# EAGLE design bbb_cape (EAGLE 7.3.0)
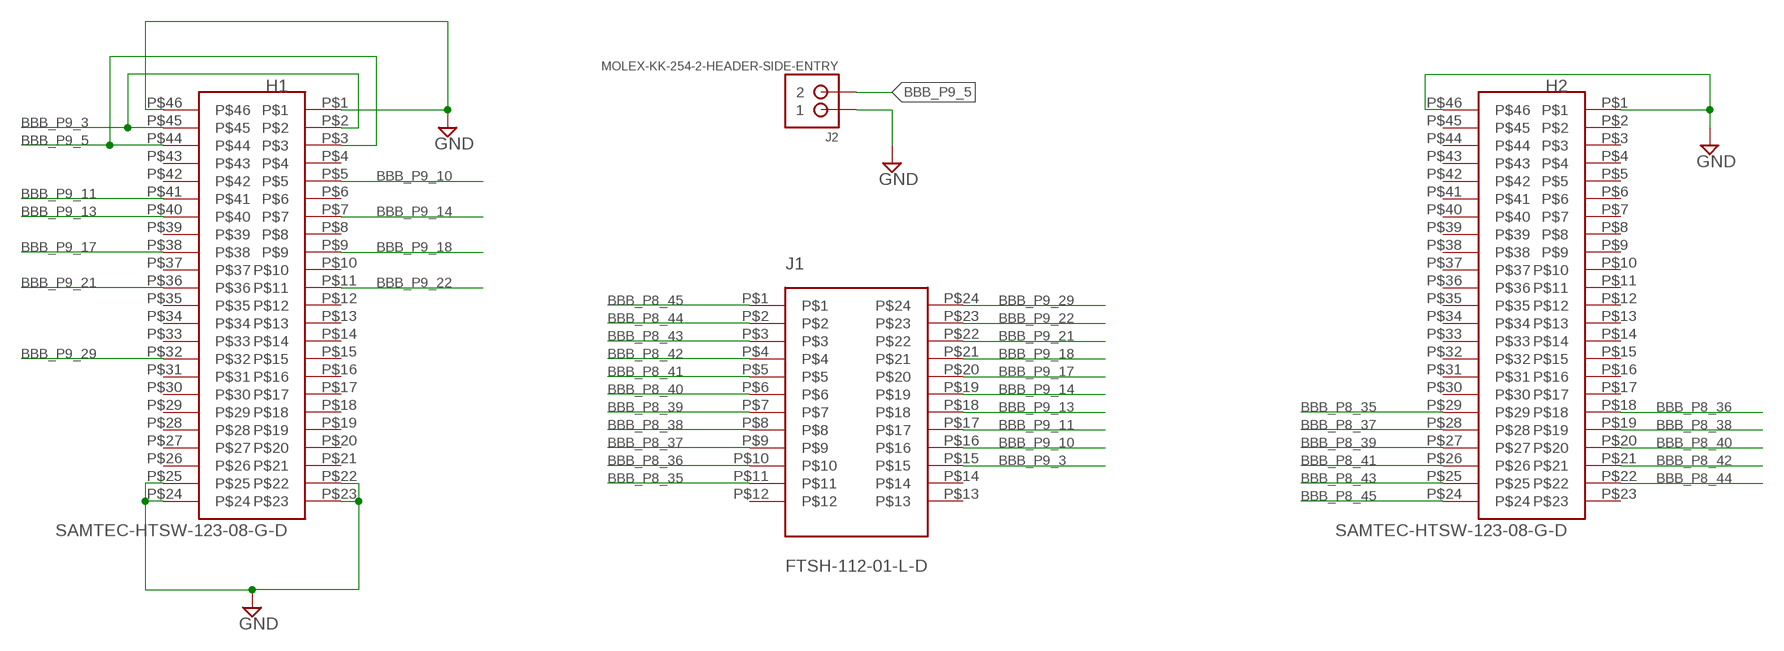
[diagram p0: schematic, sheet 1]

## Parts
H1  SAMTEC-HTSW-123-08-G-D  HEADER-2X23  [HEADER-2X23-0.1-INCH]
H2  SAMTEC-HTSW-123-08-G-D  HEADER-2X23  [HEADER-2X23-0.1-INCH]
J1  FTSH-112-01-L-D  FTSH-112-CONNSTRAIGHT  [FTSH-112-01-L-D]
J2  MOLEX-KK-254-2-HEADER-SIDE-ENTRY  [MOLEX-KK-254-2-HEADER-SIDE-ENTRY]

## Nets
BBB_P8_35: H2.P$29 J1.P$11
BBB_P8_36: H2.P$18 J1.P$10
BBB_P8_37: H2.P$28 J1.P$9
BBB_P8_38: H2.P$19 J1.P$8
BBB_P8_39: H2.P$27 J1.P$7
BBB_P8_40: H2.P$20 J1.P$6
BBB_P8_41: H2.P$26 J1.P$5
BBB_P8_42: H2.P$21 J1.P$4
BBB_P8_43: H2.P$25 J1.P$3
BBB_P8_44: H2.P$22 J1.P$2
BBB_P8_45: H2.P$24 J1.P$1
BBB_P9_3: H1.P$2 H1.P$45 J1.P$15
BBB_P9_5: H1.P$3 H1.P$44 J2.P$2
BBB_P9_10: H1.P$5 J1.P$16
BBB_P9_11: H1.P$41 J1.P$17
BBB_P9_13: H1.P$40 J1.P$18
BBB_P9_14: H1.P$7 J1.P$19
BBB_P9_17: H1.P$38 J1.P$20
BBB_P9_18: H1.P$9 J1.P$21
BBB_P9_21: H1.P$36 J1.P$22
BBB_P9_22: H1.P$11 J1.P$23
BBB_P9_29: H1.P$32 J1.P$24
GND: H1.P$1 H1.P$22 H1.P$23 H1.P$24 H1.P$25 H1.P$46 H2.P$1 H2.P$46 J2.P$1
Unconnected: H1.P$4 H1.P$6 H1.P$8 H1.P$10 H1.P$12 H1.P$13 H1.P$14 H1.P$15 H1.P$16 H1.P$17 H1.P$18 H1.P$19 H1.P$20 H1.P$21 H1.P$26 H1.P$27 H1.P$28 H1.P$29 H1.P$30 H1.P$31 H1.P$33 H1.P$34 H1.P$35 H1.P$37 H1.P$39 H1.P$42 H1.P$43 H2.P$2 H2.P$3 H2.P$4 H2.P$5 H2.P$6 H2.P$7 H2.P$8 H2.P$9 H2.P$10 H2.P$11 H2.P$12 H2.P$13 H2.P$14 H2.P$15 H2.P$16 H2.P$17 H2.P$23 H2.P$30 H2.P$31 H2.P$32 H2.P$33 H2.P$34 H2.P$35 H2.P$36 H2.P$37 H2.P$38 H2.P$39 H2.P$40 H2.P$41 H2.P$42 H2.P$43 H2.P$44 H2.P$45 J1.P$12 J1.P$13 J1.P$14

## Library data of the parts
H1 H2 = custom:HEADER-2X23: Header, Through Hole, 46 pins (2x23)
J1 = custom:FTSH-112-CONN: SAMTEC FTSH-112-* HEADER, 1.27MM (0.05 in.), 2X12 POSITION 1.75 A Current Rating @ 80 degrees C ambient Mates with FFSD, FFTP, CLP, FLE, SFMC http://www.newark.com/webapp/wcs/stores/servlet/ProductDisplay?catalogId=15003&langId=-1&urlRequestType=Base&partNumber=01R5259&storeId=10194 http://www.newark.com/webapp/wcs/stores/servlet/ProductDisplay?catalogId=15003&langId=-1&urlRequestType=Base&partNumber=01R5256&storeId=10194 Datasheet: http://www.farnell.com/datasheets/1596288.pdf Drawing: http://www.farnell.com/cad/1561347.pdf
J2 = custom:MOLEX-KK-254-2-HEADER-SIDE-ENTRY: Molex KK 254 Wire to Board Header - Side Entry - 22-12-2024 Max current per contact: 4.0 A Max voltage: 250 V 0.1 inch pitch http://www.farnell.com/datasheets/1973599.pdf

## Board
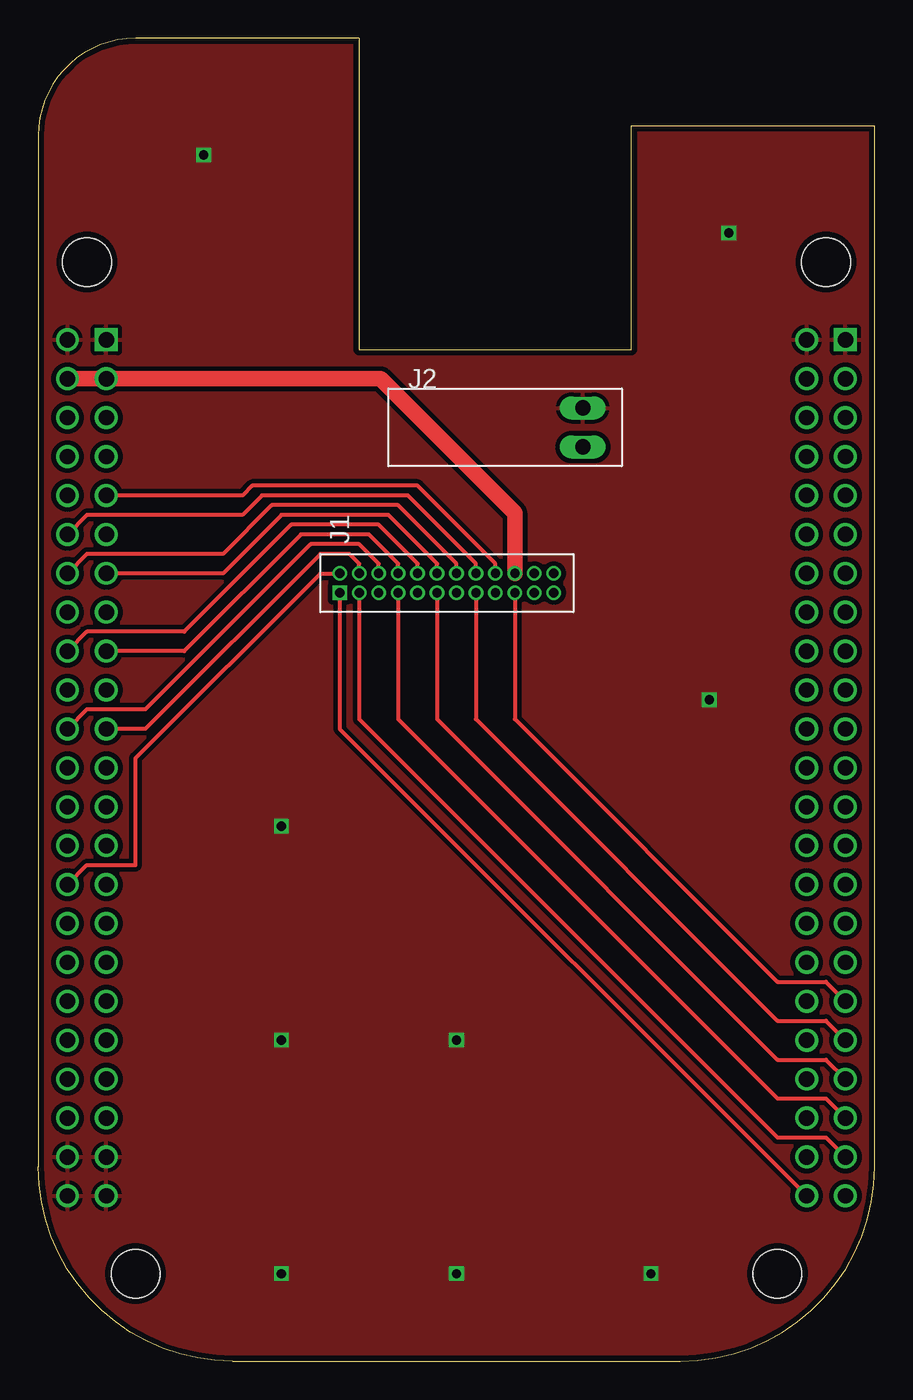
[diagram p1: board, top side]
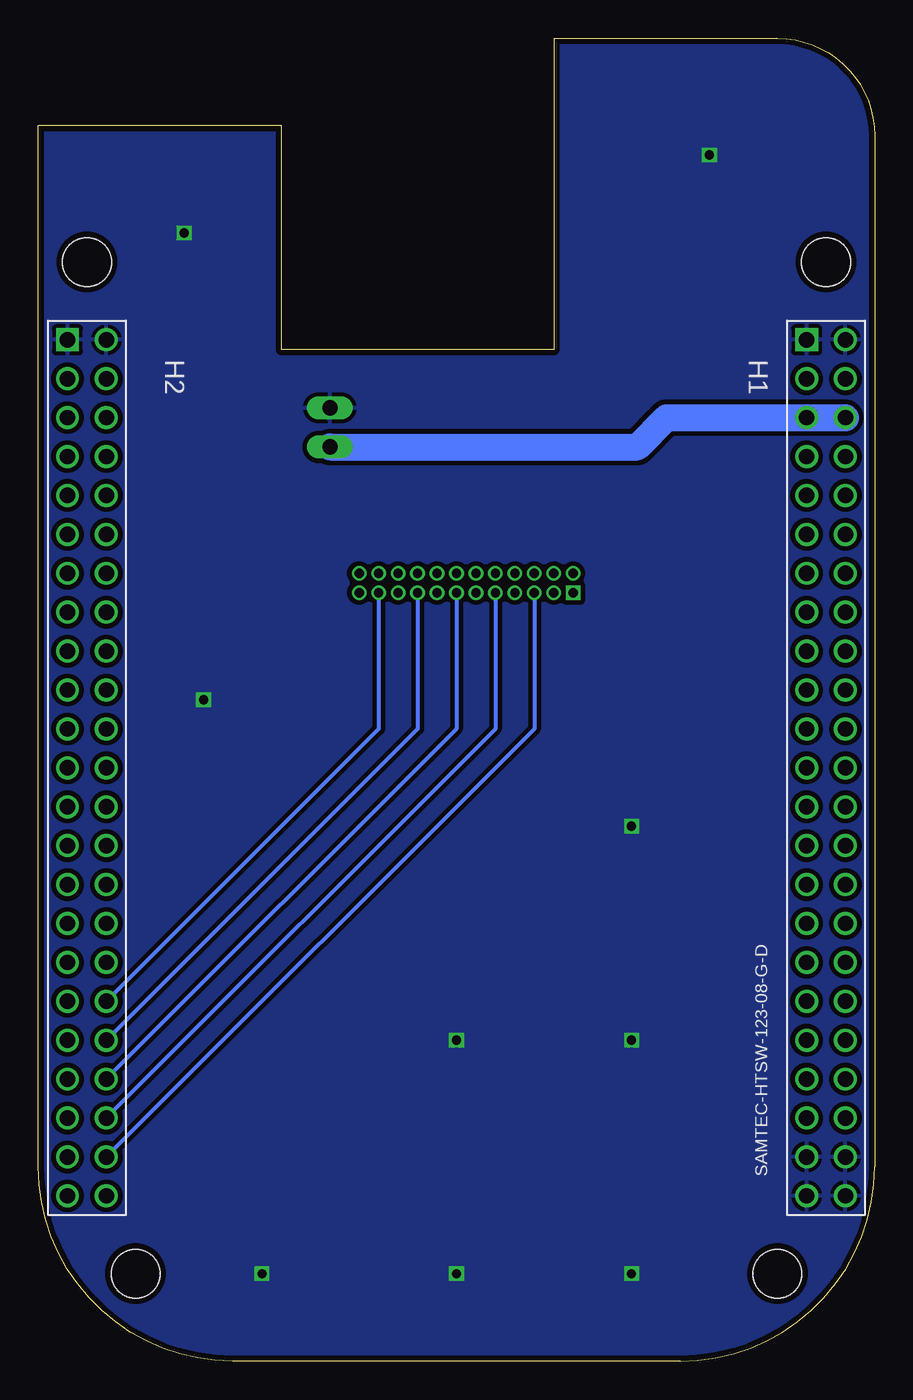
[diagram p2: board, bottom side, seen from below]

Size 54.61 x 86.36 mm. Coordinates in mm from the lower left corner, seen from the top.
Outline: 12.7,0 41.91,0 arc90 54.61,12.7 54.61,80.64 38.73,80.64 38.73,66.04 20.95,66.04 20.95,86.36 6.35,86.36 arc90 0,80.01 0,12.7 arc90 12.7,0
Copper layers (1*16): Top 0.0356mm / dielectric 1.5011mm / Bottom 0.0356mm
Design rules "LaenPCBOrder": minimum track width 6mil, minimum drill 13mil, track to track 6mil, track to pad 6mil, pad to pad 6mil, via to via 6mil, smd to smd 6mil, copper to edge 15mil, drill to drill 6mil, minimum pad ring 7mil, minimum via ring 7mil, stop-mask expansion 3mil, vias tented up to drill 0mil, thermal gap 10mil
Holes 3.17 mm at 6.35,5.71 48.26,5.71 51.44,71.75 3.17,71.75

### Footprints (pad centres in the part's own frame; a part is rotated, then mirrored left to right if it is on the bottom)
HEADER-2X23-0.1-INCH = drill 1 square: P$1 -1.27,27.94 | drill 1: P$2 -1.27,25.4; P$3 -1.27,22.86; P$4 -1.27,20.32; P$5 -1.27,17.78; P$6 -1.27,15.24; P$7 -1.27,12.7; P$8 -1.27,10.16; P$9 -1.27,7.62; P$10 -1.27,5.08; P$11 -1.27,2.54; P$12 -1.27,0; P$13 -1.27,-2.54; P$14 -1.27,-5.08; P$15 -1.27,-7.62; P$16 -1.27,-10.16; P$17 -1.27,-12.7; P$18 -1.27,-15.24; P$19 -1.27,-17.78; P$20 -1.27,-20.32; P$21 -1.27,-22.86; P$22 -1.27,-25.4; P$23 -1.27,-27.94; P$24 1.27,-27.94; P$25 1.27,-25.4; P$26 1.27,-22.86; P$27 1.27,-20.32; P$28 1.27,-17.78; P$29 1.27,-15.24; P$30 1.27,-12.7; P$31 1.27,-10.16; P$32 1.27,-7.62; P$33 1.27,-5.08; P$34 1.27,-2.54; P$35 1.27,0; P$36 1.27,2.54; P$37 1.27,5.08; P$38 1.27,7.62; P$39 1.27,10.16; P$40 1.27,12.7; P$41 1.27,15.24; P$42 1.27,17.78; P$43 1.27,20.32; P$44 1.27,22.86; P$45 1.27,25.4; P$46 1.27,27.94
FTSH-112-01-L-D = drill 0.6 pad 0.94 square: P$1 -0.635,6.985 | drill 0.6 pad 0.94: P$2 -0.635,5.715; P$3 -0.635,4.445; P$4 -0.635,3.175; P$5 -0.635,1.905; P$6 -0.635,0.635; P$7 -0.635,-0.635; P$8 -0.635,-1.905; P$9 -0.635,-3.175; P$10 -0.635,-4.445; P$11 -0.635,-5.715; P$12 -0.635,-6.985; P$13 0.635,-6.985; P$14 0.635,-5.715; P$15 0.635,-4.445; P$16 0.635,-3.175; P$17 0.635,-1.905; P$18 0.635,-0.635; P$19 0.635,0.635; P$20 0.635,1.905; P$21 0.635,3.175; P$22 0.635,4.445; P$23 0.635,5.715; P$24 0.635,6.985
MOLEX-KK-254-2-HEADER-SIDE-ENTRY = drill 1 long: P$1 0,1.27; P$2 0,-1.27

### Placement (x,y rotation side)
H1  3.17,38.73 0 bottom
H2  51.44,38.73 0 bottom
J1  26.67,50.8 90 top
J2  35.56,60.96 0 top

### Tracks (layer width: path | path; a pad name or v marks a point on that pad's centre or on a via)
BBB_P8_35
  Bottom 0.254: J1.P$11 32.38,41.27 H2.P$29
BBB_P8_36
  Top 0.254: J1.P$10 31.11,41.91 48.26,24.77 51.44,24.77 H2.P$18
BBB_P8_37
  Bottom 0.254: J1.P$9 29.84,41.27 H2.P$28
BBB_P8_38
  Top 0.254: J1.P$8 28.57,41.91 48.26,22.23 51.44,22.23 H2.P$19
BBB_P8_39
  Bottom 0.254: J1.P$7 27.3,41.27 H2.P$27
BBB_P8_40
  Top 0.254: J1.P$6 26.04,41.91 48.26,19.68 51.44,19.68 H2.P$20
BBB_P8_41
  Bottom 0.254: J1.P$5 24.77,41.27 H2.P$26
BBB_P8_42
  Top 0.254: J1.P$4 23.5,41.91 48.26,17.14 51.44,17.14 H2.P$21
BBB_P8_43
  Bottom 0.254: J1.P$3 22.23,41.27 H2.P$25
BBB_P8_44
  Top 0.254: J1.P$2 20.95,41.91 48.26,14.61 51.44,14.61 H2.P$22
BBB_P8_45
  Top 0.254: J1.P$1 19.68,41.27 H2.P$24
BBB_P9_3
  Top 1.016: H1.P$45 H1.P$2 22.35,64.14 31.11,55.37 J1.P$15
BBB_P9_5
  Bottom 1.778: J2.P$2 15.49,59.69 13.59,61.59 H1.P$3 H1.P$44
BBB_P9_10
  Top 0.254: J1.P$16 29.84,52.07 24.77,57.15 13.97,57.15 13.34,56.52 H1.P$5
BBB_P9_11
  Top 0.254: J1.P$17 28.57,52.07 24.13,56.52 14.61,56.52 13.34,55.24 3.17,55.24 H1.P$41
BBB_P9_13
  Top 0.254: J1.P$18 27.3,52.07 23.5,55.88 15.24,55.88 12.06,52.7 3.17,52.7 H1.P$40
BBB_P9_14
  Top 0.254: J1.P$19 26.04,52.07 22.86,55.24 15.88,55.24 12.06,51.44 H1.P$7
BBB_P9_17
  Top 0.254: J1.P$20 24.77,52.07 22.23,54.61 16.51,54.61 9.53,47.62 3.17,47.62 H1.P$38
BBB_P9_18
  Top 0.254: J1.P$21 23.5,52.07 21.59,53.98 17.14,53.98 9.53,46.35 H1.P$9
BBB_P9_21
  Top 0.254: J1.P$22 22.23,52.07 20.95,53.34 17.78,53.34 6.99,42.55 3.17,42.55 H1.P$36
BBB_P9_22
  Top 0.254: J1.P$23 20.95,52.07 20.32,52.7 18.41,52.7 6.99,41.27 H1.P$11
BBB_P9_29
  Top 0.254: H1.P$32 3.17,32.38 6.35,32.38 6.35,39.37 18.41,51.44 J1.P$24
GND  (via drill 0.6)
  other vias: 10.79,78.74 45.09,73.66 43.81,43.18 15.88,34.92 15.88,20.95 27.3,20.95 15.88,5.71 27.3,5.71 40.01,5.71
  pour Top (isolate 0.305): 6.35,86.36 arc90 0,80.01 0,12.7 arc90 12.7,0 41.91,0 arc90 54.61,12.7 54.61,80.64 38.73,80.64 38.73,80.14 38.73,66.04 20.95,66.04 20.95,86.36
  pour Bottom (isolate 0.305): 6.35,86.36 arc90 0,80.01 0,12.7 arc90 12.7,0 41.91,0 arc90 54.61,12.7 54.61,80.64 38.73,80.64 38.73,66.04 20.95,66.04 20.95,86.36